# EAGLE schematic Player_v0.2 (EAGLE 6.2)
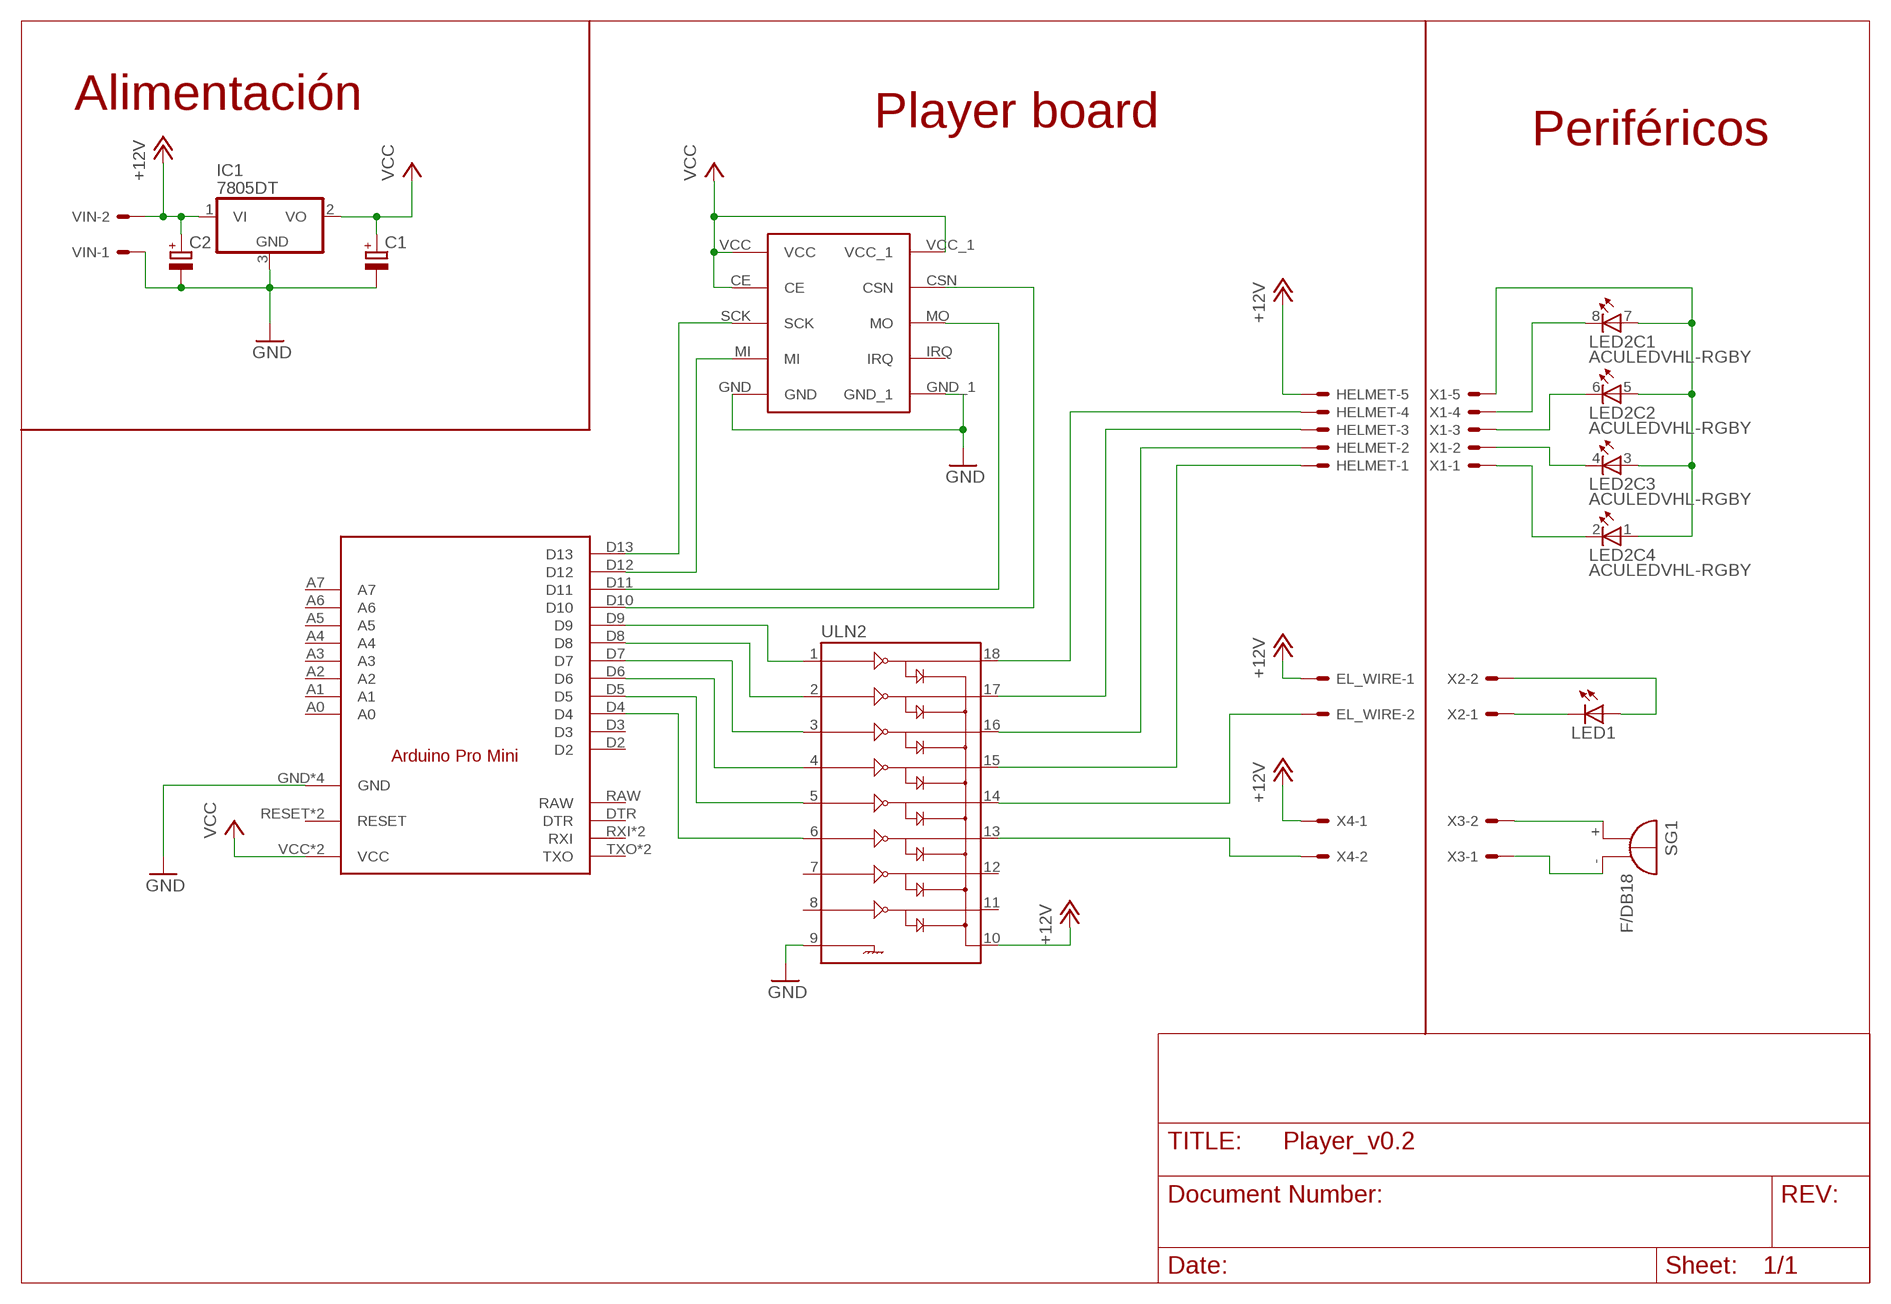
[diagram p0: schematic, sheet 1]

## Parts
C1  CPOL-EUE2.5-5  [E2,5-5]
C2  CPOL-EUE2.5-5  [E2,5-5]
EL_WIRE  KK-156-2  [KK-156-2]
HELMET  KK-156-5  [KK-156-5]
IC1  7805DT  [TO252]
LED1  LED5MM  [LED5MM]
LED2  ACULEDVHL-RGBY  [ACULEDVHL]
SG1  F/DB18  [F/DB18]
U$1  ARDUINO_PRO_MINI  [ARDUINO_PRO_MINI]
U$2  NRF24L01  [NRF24L01-DEALEXTREME]
ULN2  ULN2803SOIC  [SO018]
VIN  KK-156-2  [KK-156-2]
X1  KK-156-5  [KK-156-5]
X2  KK-156-2  [KK-156-2]
X3  KK-156-2  [KK-156-2]
X4  KK-156-2  [KK-156-2]

## Nets
+12V: C2.+ EL_WIRE.1 HELMET.5 IC1.1(VI) ULN2.10 VIN.2 X4.1
GND: C1.- C2.- U$1.GND U$1.GND1(GND) U$1.GND2(GND) U$1.GND3(GND) U$2.GND U$2.GND_1 ULN2.9 VIN.1
N$1: U$1.D8 ULN2.2
N$2: U$1.D4 ULN2.6
N$3: U$1.D6 ULN2.4
N$4: U$1.D7 ULN2.3
N$5: LED2.8(C1:C) X1.4
N$6: LED2.6(C2:C) X1.3
N$7: LED2.4(C3:C) X1.2
N$8: LED2.2(C4:C) X1.1
N$9: U$1.D12 U$2.MI
N$10: U$1.D11 U$2.MO
N$11: U$1.D13 U$2.SCK
N$12: U$1.D10 U$2.CSN
N$13: HELMET.4 ULN2.18
N$14: HELMET.3 ULN2.17
N$15: HELMET.2 ULN2.16
N$16: HELMET.1 ULN2.15
N$17: EL_WIRE.2 ULN2.14
N$23: SG1.+ X3.2
N$24: SG1.- X3.1
N$25: ULN2.13 X4.2
N$26: LED1.K(C) X2.1
N$27: LED1.A X2.2
N$28: U$1.D9 ULN2.1
N$31: LED2.1(C4:A) LED2.3(C3:A) LED2.5(C2:A) LED2.7(C1:A) X1.5
N$32: U$1.D5 ULN2.5
VCC: C1.+ IC1.2(VO) U$1.VCC U$1.VCC1(VCC) U$2.CE U$2.VCC U$2.VCC_1
Unconnected: IC1.3(GND) U$1.A0 U$1.A1 U$1.A2 U$1.A3 U$1.A4 U$1.A5 U$1.A6 U$1.A7 U$1.D2 U$1.D3 U$1.DTR U$1.RAW U$1.RESET U$1.RESET1(RESET) U$1.RXI U$1.RXI1(RXI) U$1.TXO U$1.TXO1(TXO) U$2.IRQ ULN2.7 ULN2.8 ULN2.11 ULN2.12

## Notes on the sheet
- Alimentación
- Player board
- Periféricos

## Library data of the parts
C1 C2 = rcl:CPOL-EU: POLARIZED CAPACITOR, European symbol
EL_WIRE VIN X2-X4 = con-molex:KK-156-2: KK 156 HEADER Source: http://www.molex.com/pdm_docs/sd/026604100_sd.pdf; OC_FARNELL: unknown; OC_NEWARK: unknown
HELMET X1 = con-molex:KK-156-5: KK 156 HEADER Source: http://www.molex.com/pdm_docs/sd/026604100_sd.pdf; OC_FARNELL: unknown; OC_NEWARK: unknown
IC1 = linear:78*: Positive VOLTAGE REGULATOR Source: http://cache.national.com/ds/LM/LM78L05.pdf http://www.fairchildsemi.com/ds/LM/LM7805.pdf
LED1 = adafruit:LED: LED OSRAM: - CHIPLED LG R971, LG N971, LY N971, LG Q971, LY Q971, LO R971, LY R971 LH N974, LH R974 LS Q976, LO Q976, LY Q976 LO Q996 - Hyper CHIPLED LW Q18S LB Q993, LB Q99A, LB R99A - SideLED LS A670, LO A670, LY A670, LG A670, LP A670 LB A673, LV A673, LT A673, LW A673 LH A674 LY A675 LS A676, LA A676, LO A676, LY A676, LW A676 LS A679, LY A679, LG A679 - Hyper Micro SIDELED® LS Y876, LA Y876, LO Y876, LY Y876 LT Y87S - SmartLED LW L88C, LW L88S LB L89C, LB L89S, LG L890 LS L89K, LO L89K, LY L89K LS L896, LA L896, LO L896, LY L896 - TOPLED LS T670, LO T670, LY T670, LG T670, LP T670 LSG T670, LSP T670, LSY T670, LOP T670, LYG T670 LG T671, LOG T671, LSG T671 LB T673, LV T673, LT T673, LW T673 LH T674 LS T676, LA T676, LO T676, LY T676, LB T676, LH T676, LSB T676, LW T676 LB T67C, LV T67C, LT T67C, LS T67K, LO T67K, LY T67K, LW E67C LS E67B, LA E67B, LO E67B, LY E67B, LB E67C, LV E67C, LT E67C LW T67C LS T679, LY T679, LG T679 LS T770, LO T770, LY T770, LG T770, LP T770 LB T773, LV T773, LT T773, LW T773 LH T774 LS E675, LA E675, LY E675, LS T675 LS T776, LA T776, LO T776, LY T776, LB T776 LHGB T686 LT T68C, LB T68C - Hyper Mini TOPLED® LB M676 - Mini TOPLED Santana® LG M470 LS M47K, LO M47K, LY M47K Source: http://www.osram.convergy.de/
LED2 = led:ACULEDVHL: ACULED® VHL Standard Monochromatic and Multi-Colored Four-Chip LED Source: http://optoelectronics.perkinelmer.com/content/Datasheets/DTS_ACULEDVHL.pdf
SG1 = buzzer:F/DB18: BUZZER Source: Buerklin; OC_FARNELL: unknown; OC_NEWARK: unknown
U$1 = MimaZ:ARDUINO_PRO_MINI: Arduino Pro Mini http://arduino.cc/en/Main/ArduinoBoardProMini
U$2 = nrf24l01_DealExtreme:NRF24L01
ULN2 = SparkFun-PowerIC:ULN2803: Darlington Driver ULN2803 Darlington array. 500mA max per channel, 8-channel package. Spark Fun Electronics SKU : COM-00312